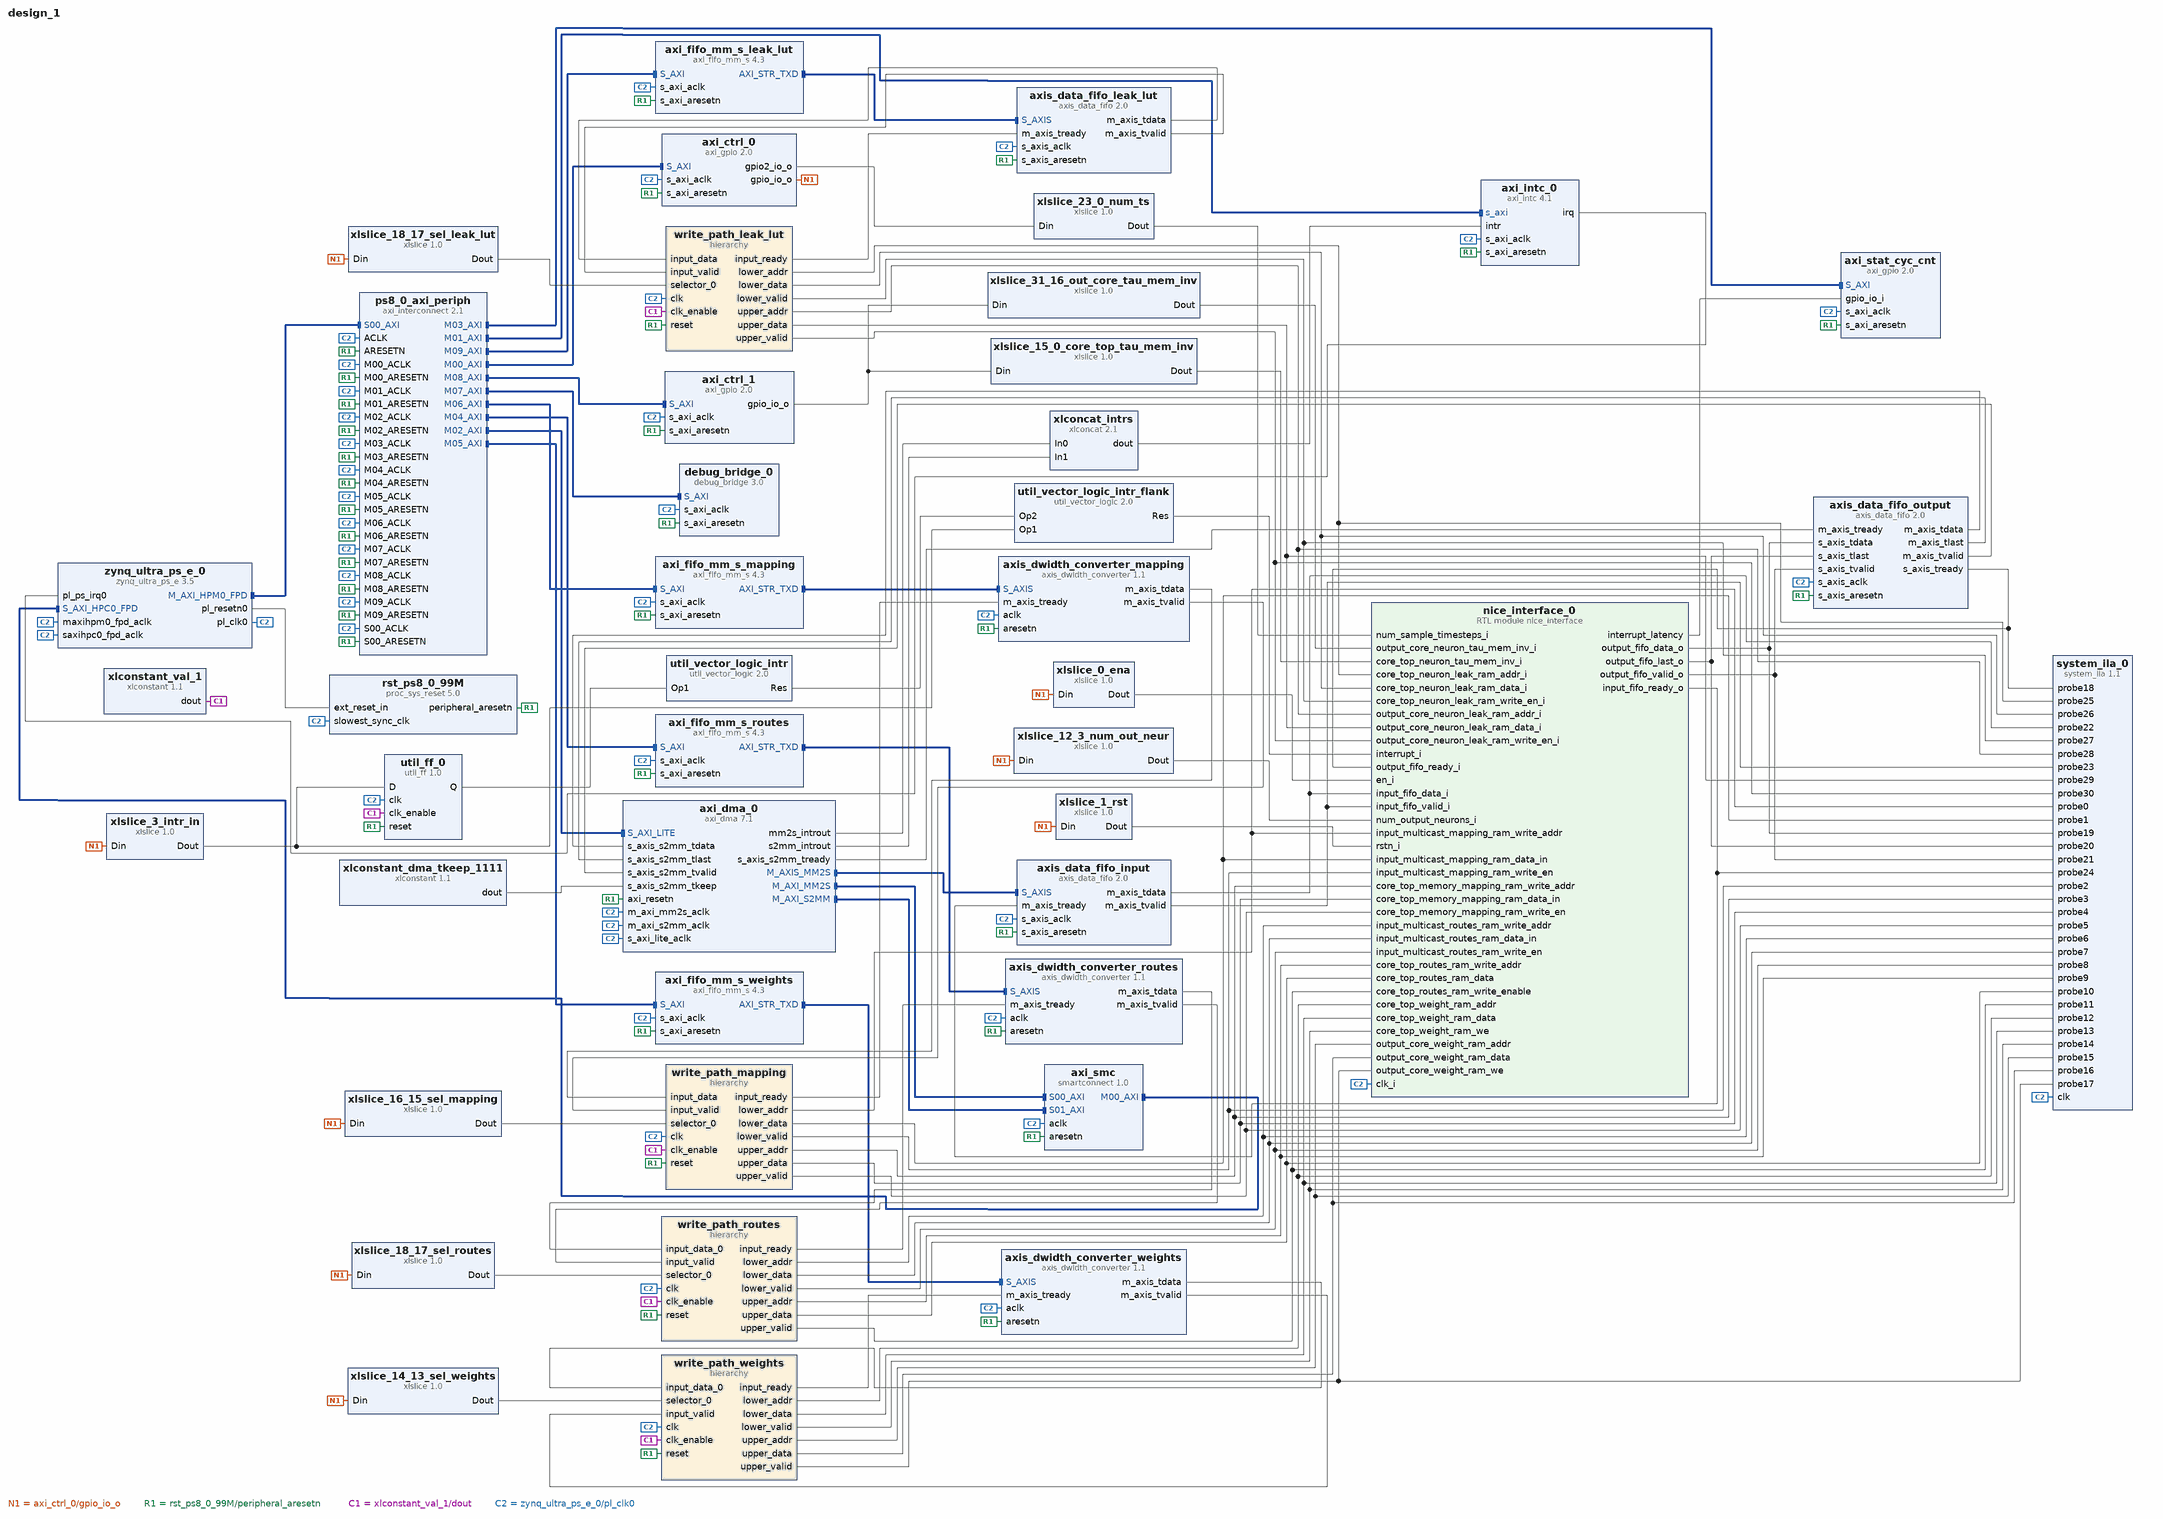
[diagram p0: block diagram of the top level]
# Vivado block design design_1, xck26-sfvc784-2LV-c, Vivado 2024.1
create_bd_design design_1

create_bd_cell -type ip -vlnv xilinx.com:ip:zynq_ultra_ps_e:3.5 zynq_ultra_ps_e_0
set_property -dict [list \
  CONFIG.PSU_BANK_0_IO_STANDARD LVCMOS18 \
  CONFIG.PSU_BANK_1_IO_STANDARD LVCMOS18 \
  CONFIG.PSU_BANK_2_IO_STANDARD LVCMOS18 \
  CONFIG.PSU_BANK_3_IO_STANDARD LVCMOS18 \
  CONFIG.PSU__CRF_APB__ACPU_CTRL__FREQMHZ 1333.333 \
  CONFIG.PSU__CRF_APB__ACPU_CTRL__SRCSEL APLL \
  CONFIG.PSU__CRF_APB__APLL_CTRL__SRCSEL PSS_REF_CLK \
  CONFIG.PSU__CRF_APB__APLL_FRAC_CFG__ENABLED 1 \
  CONFIG.PSU__CRF_APB__DBG_FPD_CTRL__FREQMHZ 250 \
  CONFIG.PSU__CRF_APB__DBG_FPD_CTRL__SRCSEL IOPLL \
  CONFIG.PSU__CRF_APB__DBG_TRACE_CTRL__FREQMHZ 250 \
  CONFIG.PSU__CRF_APB__DBG_TRACE_CTRL__SRCSEL IOPLL \
  CONFIG.PSU__CRF_APB__DBG_TSTMP_CTRL__FREQMHZ 250 \
  CONFIG.PSU__CRF_APB__DBG_TSTMP_CTRL__SRCSEL IOPLL \
  CONFIG.PSU__CRF_APB__DDR_CTRL__FREQMHZ 1200 \
  CONFIG.PSU__CRF_APB__DDR_CTRL__SRCSEL DPLL \
  CONFIG.PSU__CRF_APB__DPDMA_REF_CTRL__FREQMHZ 600 \
  CONFIG.PSU__CRF_APB__DPDMA_REF_CTRL__SRCSEL APLL \
  CONFIG.PSU__CRF_APB__DPLL_CTRL__SRCSEL PSS_REF_CLK \
  CONFIG.PSU__CRF_APB__DP_AUDIO_REF_CTRL__SRCSEL RPLL \
  CONFIG.PSU__CRF_APB__DP_STC_REF_CTRL__SRCSEL RPLL \
  CONFIG.PSU__CRF_APB__DP_VIDEO_REF_CTRL__SRCSEL VPLL \
  CONFIG.PSU__CRF_APB__GDMA_REF_CTRL__FREQMHZ 600 \
  CONFIG.PSU__CRF_APB__GDMA_REF_CTRL__SRCSEL DPLL \
  CONFIG.PSU__CRF_APB__GPU_REF_CTRL__FREQMHZ 600 \
  CONFIG.PSU__CRF_APB__GPU_REF_CTRL__SRCSEL IOPLL \
  CONFIG.PSU__CRF_APB__TOPSW_LSBUS_CTRL__FREQMHZ 100 \
  CONFIG.PSU__CRF_APB__TOPSW_LSBUS_CTRL__SRCSEL IOPLL \
  CONFIG.PSU__CRF_APB__TOPSW_MAIN_CTRL__FREQMHZ 533.33 \
  CONFIG.PSU__CRF_APB__TOPSW_MAIN_CTRL__SRCSEL DPLL \
  CONFIG.PSU__CRF_APB__VPLL_CTRL__SRCSEL PSS_REF_CLK \
  CONFIG.PSU__CRL_APB__ADMA_REF_CTRL__FREQMHZ 500 \
  CONFIG.PSU__CRL_APB__ADMA_REF_CTRL__SRCSEL IOPLL \
  CONFIG.PSU__CRL_APB__CPU_R5_CTRL__FREQMHZ 533.333 \
  CONFIG.PSU__CRL_APB__CPU_R5_CTRL__SRCSEL RPLL \
  CONFIG.PSU__CRL_APB__DBG_LPD_CTRL__FREQMHZ 250 \
  CONFIG.PSU__CRL_APB__DBG_LPD_CTRL__SRCSEL IOPLL \
  CONFIG.PSU__CRL_APB__IOPLL_CTRL__SRCSEL PSS_REF_CLK \
  CONFIG.PSU__CRL_APB__IOU_SWITCH_CTRL__FREQMHZ 250 \
  CONFIG.PSU__CRL_APB__IOU_SWITCH_CTRL__SRCSEL IOPLL \
  CONFIG.PSU__CRL_APB__LPD_LSBUS_CTRL__FREQMHZ 100 \
  CONFIG.PSU__CRL_APB__LPD_LSBUS_CTRL__SRCSEL IOPLL \
  CONFIG.PSU__CRL_APB__LPD_SWITCH_CTRL__FREQMHZ 500 \
  CONFIG.PSU__CRL_APB__LPD_SWITCH_CTRL__SRCSEL IOPLL \
  CONFIG.PSU__CRL_APB__PCAP_CTRL__FREQMHZ 200 \
  CONFIG.PSU__CRL_APB__PCAP_CTRL__SRCSEL IOPLL \
  CONFIG.PSU__CRL_APB__PL0_REF_CTRL__FREQMHZ 100 \
  CONFIG.PSU__CRL_APB__PL0_REF_CTRL__SRCSEL IOPLL \
  CONFIG.PSU__CRL_APB__QSPI_REF_CTRL__FREQMHZ 125 \
  CONFIG.PSU__CRL_APB__QSPI_REF_CTRL__SRCSEL IOPLL \
  CONFIG.PSU__CRL_APB__RPLL_CTRL__SRCSEL PSS_REF_CLK \
  CONFIG.PSU__CRL_APB__SPI1_REF_CTRL__SRCSEL IOPLL \
  CONFIG.PSU__CRL_APB__TIMESTAMP_REF_CTRL__FREQMHZ 100 \
  CONFIG.PSU__CRL_APB__TIMESTAMP_REF_CTRL__SRCSEL IOPLL \
  CONFIG.PSU__CSUPMU__PERIPHERAL__VALID 1 \
  CONFIG.PSU__DDRC__BUS_WIDTH {64 Bit} \
  CONFIG.PSU__DDRC__COMPONENTS Components \
  CONFIG.PSU__DDRC__DEVICE_CAPACITY {8192 MBits} \
  CONFIG.PSU__DDRC__DRAM_WIDTH {16 Bits} \
  CONFIG.PSU__DDRC__ECC Disabled \
  CONFIG.PSU__DDRC__MEMORY_TYPE {DDR 4} \
  CONFIG.PSU__DDRC__SPEED_BIN DDR4_2400R \
  CONFIG.PSU__DDR_HIGH_ADDRESS_GUI_ENABLE 1 \
  CONFIG.PSU__DDR__INTERFACE__FREQMHZ 600.000 \
  CONFIG.PSU__DISPLAYPORT__LANE0__ENABLE 0 \
  CONFIG.PSU__DISPLAYPORT__LANE1__ENABLE 0 \
  CONFIG.PSU__DISPLAYPORT__PERIPHERAL__ENABLE 1 \
  CONFIG.PSU__DPAUX__PERIPHERAL__ENABLE 1 \
  CONFIG.PSU__DPAUX__PERIPHERAL__IO {MIO 27 .. 30} \
  CONFIG.PSU__DP__LANE_SEL None \
  CONFIG.PSU__FPGA_PL0_ENABLE 1 \
  CONFIG.PSU__GPIO0_MIO__IO {MIO 0 .. 25} \
  CONFIG.PSU__GPIO0_MIO__PERIPHERAL__ENABLE 1 \
  CONFIG.PSU__GPIO1_MIO__IO {MIO 26 .. 51} \
  CONFIG.PSU__GPIO1_MIO__PERIPHERAL__ENABLE 1 \
  CONFIG.PSU__GT__LINK_SPEED HBR \
  CONFIG.PSU__GT__PRE_EMPH_LVL_4 0 \
  CONFIG.PSU__GT__VLT_SWNG_LVL_4 0 \
  CONFIG.PSU__IOU_SLCR__IOU_TTC_APB_CLK__TTC0_SEL APB \
  CONFIG.PSU__IOU_SLCR__IOU_TTC_APB_CLK__TTC1_SEL APB \
  CONFIG.PSU__IOU_SLCR__IOU_TTC_APB_CLK__TTC2_SEL APB \
  CONFIG.PSU__IOU_SLCR__IOU_TTC_APB_CLK__TTC3_SEL APB \
  CONFIG.PSU__MAXIGP0__DATA_WIDTH 128 \
  CONFIG.PSU__OVERRIDE__BASIC_CLOCK 0 \
  CONFIG.PSU__PMU_COHERENCY 0 \
  CONFIG.PSU__PMU__AIBACK__ENABLE 0 \
  CONFIG.PSU__PMU__EMIO_GPI__ENABLE 0 \
  CONFIG.PSU__PMU__EMIO_GPO__ENABLE 0 \
  CONFIG.PSU__PMU__GPI0__ENABLE 1 \
  CONFIG.PSU__PMU__GPI0__IO {MIO 26} \
  CONFIG.PSU__PMU__GPI1__ENABLE 0 \
  CONFIG.PSU__PMU__GPI2__ENABLE 0 \
  CONFIG.PSU__PMU__GPI3__ENABLE 0 \
  CONFIG.PSU__PMU__GPI4__ENABLE 0 \
  CONFIG.PSU__PMU__GPI5__ENABLE 1 \
  CONFIG.PSU__PMU__GPI5__IO {MIO 31} \
  CONFIG.PSU__PMU__GPO0__ENABLE 0 \
  CONFIG.PSU__PMU__GPO1__ENABLE 0 \
  CONFIG.PSU__PMU__GPO2__ENABLE 0 \
  CONFIG.PSU__PMU__GPO3__ENABLE 1 \
  CONFIG.PSU__PMU__GPO3__IO {MIO 35} \
  CONFIG.PSU__PMU__GPO3__POLARITY low \
  CONFIG.PSU__PMU__GPO4__ENABLE 0 \
  CONFIG.PSU__PMU__GPO5__ENABLE 0 \
  CONFIG.PSU__PMU__PERIPHERAL__ENABLE 1 \
  CONFIG.PSU__PMU__PLERROR__ENABLE 0 \
  CONFIG.PSU__PRESET_APPLIED 1 \
  CONFIG.PSU__PSS_REF_CLK__FREQMHZ 33.333 \
  CONFIG.PSU__QSPI_COHERENCY 0 \
  CONFIG.PSU__QSPI_ROUTE_THROUGH_FPD 0 \
  CONFIG.PSU__QSPI__GRP_FBCLK__ENABLE 0 \
  CONFIG.PSU__QSPI__PERIPHERAL__DATA_MODE x4 \
  CONFIG.PSU__QSPI__PERIPHERAL__ENABLE 1 \
  CONFIG.PSU__QSPI__PERIPHERAL__IO {MIO 0 .. 5} \
  CONFIG.PSU__QSPI__PERIPHERAL__MODE Single \
  CONFIG.PSU__SPI1__GRP_SS0__IO {MIO 9} \
  CONFIG.PSU__SPI1__PERIPHERAL__ENABLE 1 \
  CONFIG.PSU__SPI1__PERIPHERAL__IO {MIO 6 .. 11} \
  CONFIG.PSU__SWDT0__CLOCK__ENABLE 0 \
  CONFIG.PSU__SWDT0__PERIPHERAL__ENABLE 1 \
  CONFIG.PSU__SWDT0__RESET__ENABLE 0 \
  CONFIG.PSU__SWDT1__CLOCK__ENABLE 0 \
  CONFIG.PSU__SWDT1__PERIPHERAL__ENABLE 1 \
  CONFIG.PSU__SWDT1__RESET__ENABLE 0 \
  CONFIG.PSU__TTC0__CLOCK__ENABLE 0 \
  CONFIG.PSU__TTC0__PERIPHERAL__ENABLE 1 \
  CONFIG.PSU__TTC0__WAVEOUT__ENABLE 0 \
  CONFIG.PSU__TTC1__CLOCK__ENABLE 0 \
  CONFIG.PSU__TTC1__PERIPHERAL__ENABLE 1 \
  CONFIG.PSU__TTC1__WAVEOUT__ENABLE 0 \
  CONFIG.PSU__TTC2__CLOCK__ENABLE 0 \
  CONFIG.PSU__TTC2__PERIPHERAL__ENABLE 1 \
  CONFIG.PSU__TTC2__WAVEOUT__ENABLE 0 \
  CONFIG.PSU__TTC3__CLOCK__ENABLE 0 \
  CONFIG.PSU__TTC3__PERIPHERAL__ENABLE 1 \
  CONFIG.PSU__TTC3__WAVEOUT__ENABLE 0 \
  CONFIG.PSU__USE__IRQ0 1 \
  CONFIG.PSU__USE__M_AXI_GP0 1 \
  CONFIG.PSU__USE__M_AXI_GP1 0 \
  CONFIG.PSU__USE__M_AXI_GP2 0 \
  CONFIG.PSU__USE__S_AXI_GP0 1 \
] [get_bd_cells zynq_ultra_ps_e_0]
# 257 more settings of zynq_ultra_ps_e_0 are not shown: defaults, MIO pin electricals, DDR timing, and values the tool derives
create_bd_cell -type ip -vlnv xilinx.com:ip:axi_gpio:2.0 axi_ctrl_0
set_property -dict {CONFIG.C_ALL_OUTPUTS 1 CONFIG.C_ALL_OUTPUTS_2 1 CONFIG.C_IS_DUAL 1} [get_bd_cells axi_ctrl_0]
create_bd_cell -type ip -vlnv xilinx.com:ip:axi_interconnect:2.1 ps8_0_axi_periph
set_property -dict {CONFIG.NUM_MI 10} [get_bd_cells ps8_0_axi_periph]
create_bd_cell -type ip -vlnv xilinx.com:ip:proc_sys_reset:5.0 rst_ps8_0_99M
create_bd_cell -type ip -vlnv xilinx.com:ip:axi_intc:4.1 axi_intc_0
create_bd_cell -type ip -vlnv xilinx.com:ip:axi_dma:7.1 axi_dma_0
set_property -dict [list \
  CONFIG.c_include_sg 0 \
  CONFIG.c_s_axis_s2mm_tdata_width 32 \
  CONFIG.c_sg_length_width 26 \
] [get_bd_cells axi_dma_0]
create_bd_cell -type ip -vlnv xilinx.com:ip:smartconnect:1.0 axi_smc
set_property -dict {CONFIG.NUM_SI 2} [get_bd_cells axi_smc]
create_bd_cell -type ip -vlnv xilinx.com:ip:xlconcat:2.1 xlconcat_intrs
create_bd_cell -type ip -vlnv xilinx.com:ip:axis_data_fifo:2.0 axis_data_fifo_input
set_property -dict {CONFIG.FIFO_DEPTH 32768 CONFIG.TDATA_NUM_BYTES 4} [get_bd_cells axis_data_fifo_input]
create_bd_cell -type ip -vlnv xilinx.com:ip:axis_data_fifo:2.0 axis_data_fifo_output
set_property -dict [list \
  CONFIG.FIFO_DEPTH 32 \
  CONFIG.FIFO_MEMORY_TYPE distributed \
  CONFIG.HAS_TLAST 1 \
  CONFIG.TDATA_NUM_BYTES 4 \
] [get_bd_cells axis_data_fifo_output]
create_bd_cell -type module -reference nice_interface nice_interface_0
create_bd_cell -type ip -vlnv xilinx.com:ip:xlslice:1.0 xlslice_0_ena
create_bd_cell -type ip -vlnv xilinx.com:ip:xlslice:1.0 xlslice_1_rst
set_property -dict {CONFIG.DIN_FROM 1 CONFIG.DIN_TO 1} [get_bd_cells xlslice_1_rst]
create_bd_cell -type ip -vlnv xilinx.com:ip:xlslice:1.0 xlslice_3_intr_in
set_property -dict {CONFIG.DIN_FROM 2 CONFIG.DIN_TO 2} [get_bd_cells xlslice_3_intr_in]
create_bd_cell -type ip -vlnv xilinx.com:ip:util_ff:1.0 util_ff_0
create_bd_cell -type ip -vlnv xilinx.com:ip:xlconstant:1.1 xlconstant_val_1
create_bd_cell -type ip -vlnv xilinx.com:ip:util_vector_logic:2.0 util_vector_logic_intr
set_property -dict {CONFIG.C_OPERATION not CONFIG.C_SIZE 1} [get_bd_cells util_vector_logic_intr]
create_bd_cell -type ip -vlnv xilinx.com:ip:util_vector_logic:2.0 util_vector_logic_intr_flank
set_property -dict {CONFIG.C_OPERATION and CONFIG.C_SIZE 1} [get_bd_cells util_vector_logic_intr_flank]
create_bd_cell -type ip -vlnv xilinx.com:ip:xlslice:1.0 xlslice_12_3_num_out_neur
set_property -dict {CONFIG.DIN_FROM 12 CONFIG.DIN_TO 3} [get_bd_cells xlslice_12_3_num_out_neur]
create_bd_cell -type ip -vlnv xilinx.com:ip:xlslice:1.0 xlslice_23_0_num_ts
set_property -dict {CONFIG.DIN_FROM 23 CONFIG.DIN_TO 0} [get_bd_cells xlslice_23_0_num_ts]
create_bd_cell -type ip -vlnv xilinx.com:ip:axi_gpio:2.0 axi_stat_cyc_cnt
set_property -dict {CONFIG.C_ALL_INPUTS 1} [get_bd_cells axi_stat_cyc_cnt]
create_bd_cell -type ip -vlnv xilinx.com:ip:axi_fifo_mm_s:4.3 axi_fifo_mm_s_routes
set_property -dict {CONFIG.C_USE_RX_DATA 0 CONFIG.C_USE_TX_CTRL 0} [get_bd_cells axi_fifo_mm_s_routes]
create_bd_cell -type ip -vlnv xilinx.com:ip:axis_dwidth_converter:1.1 axis_dwidth_converter_routes
set_property -dict {CONFIG.M_TDATA_NUM_BYTES 12} [get_bd_cells axis_dwidth_converter_routes]
create_bd_cell -type ip -vlnv xilinx.com:ip:axi_fifo_mm_s:4.3 axi_fifo_mm_s_weights
set_property -dict {CONFIG.C_USE_RX_DATA 0 CONFIG.C_USE_TX_CTRL 0} [get_bd_cells axi_fifo_mm_s_weights]
create_bd_cell -type ip -vlnv xilinx.com:ip:axis_dwidth_converter:1.1 axis_dwidth_converter_weights
set_property -dict {CONFIG.M_TDATA_NUM_BYTES 12} [get_bd_cells axis_dwidth_converter_weights]
create_bd_cell -type ip -vlnv xilinx.com:ip:axi_fifo_mm_s:4.3 axi_fifo_mm_s_mapping
set_property -dict {CONFIG.C_USE_RX_DATA 0 CONFIG.C_USE_TX_CTRL 0} [get_bd_cells axi_fifo_mm_s_mapping]
create_bd_cell -type ip -vlnv xilinx.com:ip:axis_dwidth_converter:1.1 axis_dwidth_converter_mapping
set_property -dict {CONFIG.M_TDATA_NUM_BYTES 8} [get_bd_cells axis_dwidth_converter_mapping]
create_bd_cell -type hier write_path_mapping
create_bd_cell -type hier write_path_weights
create_bd_cell -type hier write_path_routes
create_bd_cell -type ip -vlnv xilinx.com:ip:xlslice:1.0 xlslice_14_13_sel_weights
set_property -dict {CONFIG.DIN_FROM 14 CONFIG.DIN_TO 13} [get_bd_cells xlslice_14_13_sel_weights]
create_bd_cell -type ip -vlnv xilinx.com:ip:xlslice:1.0 xlslice_16_15_sel_mapping
set_property -dict {CONFIG.DIN_FROM 16 CONFIG.DIN_TO 15} [get_bd_cells xlslice_16_15_sel_mapping]
create_bd_cell -type ip -vlnv xilinx.com:ip:xlslice:1.0 xlslice_18_17_sel_routes
set_property -dict {CONFIG.DIN_FROM 18 CONFIG.DIN_TO 17} [get_bd_cells xlslice_18_17_sel_routes]
create_bd_cell -type ip -vlnv xilinx.com:ip:xlconstant:1.1 xlconstant_dma_tkeep_1111
set_property -dict {CONFIG.CONST_VAL 15 CONFIG.CONST_WIDTH 4} [get_bd_cells xlconstant_dma_tkeep_1111]
create_bd_cell -type ip -vlnv xilinx.com:ip:system_ila:1.1 system_ila_0
set_property -dict [list \
  CONFIG.C_MON_TYPE NATIVE \
  CONFIG.C_NUM_OF_PROBES 31 \
  CONFIG.C_PROBE0_TYPE 0 \
  CONFIG.C_PROBE10_TYPE 0 \
  CONFIG.C_PROBE11_TYPE 0 \
  CONFIG.C_PROBE12_TYPE 0 \
  CONFIG.C_PROBE13_TYPE 0 \
  CONFIG.C_PROBE14_TYPE 0 \
  CONFIG.C_PROBE15_TYPE 0 \
  CONFIG.C_PROBE16_TYPE 0 \
  CONFIG.C_PROBE17_TYPE 0 \
  CONFIG.C_PROBE18_TYPE 0 \
  CONFIG.C_PROBE19_TYPE 0 \
  CONFIG.C_PROBE1_TYPE 0 \
  CONFIG.C_PROBE20_TYPE 0 \
  CONFIG.C_PROBE21_TYPE 0 \
  CONFIG.C_PROBE22_TYPE 0 \
  CONFIG.C_PROBE23_TYPE 0 \
  CONFIG.C_PROBE24_TYPE 0 \
  CONFIG.C_PROBE25_TYPE 0 \
  CONFIG.C_PROBE26_TYPE 0 \
  CONFIG.C_PROBE27_TYPE 0 \
  CONFIG.C_PROBE28_TYPE 0 \
  CONFIG.C_PROBE29_TYPE 0 \
  CONFIG.C_PROBE2_TYPE 0 \
  CONFIG.C_PROBE30_TYPE 0 \
  CONFIG.C_PROBE3_TYPE 0 \
  CONFIG.C_PROBE4_TYPE 0 \
  CONFIG.C_PROBE5_TYPE 0 \
  CONFIG.C_PROBE6_TYPE 0 \
  CONFIG.C_PROBE7_TYPE 0 \
  CONFIG.C_PROBE8_TYPE 0 \
  CONFIG.C_PROBE9_TYPE 0 \
] [get_bd_cells system_ila_0]
create_bd_cell -type ip -vlnv xilinx.com:ip:debug_bridge:3.0 debug_bridge_0
set_property -dict {CONFIG.C_DEBUG_MODE 2} [get_bd_cells debug_bridge_0]
create_bd_cell -type ip -vlnv xilinx.com:ip:axi_gpio:2.0 axi_ctrl_1
set_property -dict {CONFIG.C_ALL_OUTPUTS 1} [get_bd_cells axi_ctrl_1]
create_bd_cell -type ip -vlnv xilinx.com:ip:xlslice:1.0 xlslice_31_16_out_core_tau_mem_inv
set_property -dict {CONFIG.DIN_FROM 31 CONFIG.DIN_TO 16} [get_bd_cells xlslice_31_16_out_core_tau_mem_inv]
create_bd_cell -type ip -vlnv xilinx.com:ip:xlslice:1.0 xlslice_15_0_core_top_tau_mem_inv
set_property -dict {CONFIG.DIN_FROM 15 CONFIG.DIN_TO 0} [get_bd_cells xlslice_15_0_core_top_tau_mem_inv]
create_bd_cell -type hier write_path_leak_lut
create_bd_cell -type ip -vlnv xilinx.com:ip:axi_fifo_mm_s:4.3 axi_fifo_mm_s_leak_lut
set_property -dict {CONFIG.C_USE_RX_DATA 0 CONFIG.C_USE_TX_CTRL 0} [get_bd_cells axi_fifo_mm_s_leak_lut]
create_bd_cell -type ip -vlnv xilinx.com:ip:axis_data_fifo:2.0 axis_data_fifo_leak_lut
set_property -dict [list \
  CONFIG.FIFO_DEPTH 16 \
  CONFIG.FIFO_MEMORY_TYPE distributed \
  CONFIG.TDATA_NUM_BYTES 4 \
] [get_bd_cells axis_data_fifo_leak_lut]
create_bd_cell -type ip -vlnv xilinx.com:ip:xlslice:1.0 xlslice_18_17_sel_leak_lut
set_property -dict {CONFIG.DIN_FROM 20 CONFIG.DIN_TO 19} [get_bd_cells xlslice_18_17_sel_leak_lut]

# ---- hierarchy /write_path_mapping ----
current_bd_instance /write_path_mapping
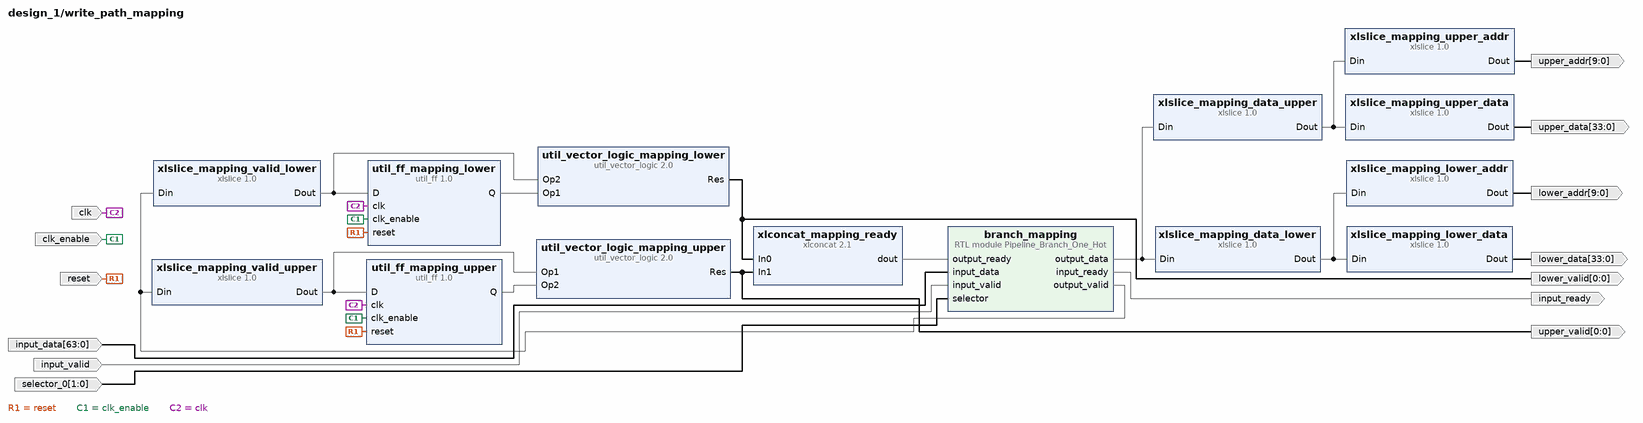
[diagram p1: block diagram inside /write_path_mapping]
create_bd_pin -dir I -from 1 -to 0 selector_0
create_bd_pin -dir I input_valid
create_bd_pin -dir O input_ready
create_bd_pin -dir I -from 63 -to 0 input_data
create_bd_pin -dir O -from 9 -to 0 upper_addr
create_bd_pin -dir I -type clk clk
create_bd_pin -dir I -type rst reset
create_bd_pin -dir I clk_enable
create_bd_pin -dir O -from 9 -to 0 lower_addr
create_bd_pin -dir O -from 0 -to 0 lower_valid
create_bd_pin -dir O -from 0 -to 0 upper_valid
create_bd_pin -dir O -from 33 -to 0 upper_data
create_bd_pin -dir O -from 33 -to 0 lower_data

create_bd_cell -type ip -vlnv xilinx.com:ip:util_vector_logic:2.0 util_vector_logic_mapping_lower
set_property -dict {CONFIG.C_SIZE 1} [get_bd_cells util_vector_logic_mapping_lower]
create_bd_cell -type ip -vlnv xilinx.com:ip:xlslice:1.0 xlslice_mapping_data_upper
set_property -dict {CONFIG.DIN_FROM 127 CONFIG.DIN_TO 64 CONFIG.DIN_WIDTH 128} [get_bd_cells xlslice_mapping_data_upper]
create_bd_cell -type ip -vlnv xilinx.com:ip:xlslice:1.0 xlslice_mapping_valid_upper
set_property -dict {CONFIG.DIN_FROM 1 CONFIG.DIN_TO 1 CONFIG.DIN_WIDTH 2} [get_bd_cells xlslice_mapping_valid_upper]
create_bd_cell -type ip -vlnv xilinx.com:ip:xlslice:1.0 xlslice_mapping_lower_data
set_property -dict {CONFIG.DIN_FROM 33 CONFIG.DIN_WIDTH 64} [get_bd_cells xlslice_mapping_lower_data]
create_bd_cell -type module -reference Pipeline_Branch_One_Hot branch_mapping
set_property -dict {CONFIG.OUTPUT_COUNT 2 CONFIG.TOTAL_WIDTH 128 CONFIG.WORD_WIDTH 64} [get_bd_cells branch_mapping]
create_bd_cell -type ip -vlnv xilinx.com:ip:util_vector_logic:2.0 util_vector_logic_mapping_upper
set_property -dict {CONFIG.C_SIZE 1} [get_bd_cells util_vector_logic_mapping_upper]
create_bd_cell -type ip -vlnv xilinx.com:ip:xlslice:1.0 xlslice_mapping_data_lower
set_property -dict {CONFIG.DIN_FROM 63 CONFIG.DIN_TO 0 CONFIG.DIN_WIDTH 128} [get_bd_cells xlslice_mapping_data_lower]
create_bd_cell -type ip -vlnv xilinx.com:ip:xlslice:1.0 xlslice_mapping_upper_addr
set_property -dict {CONFIG.DIN_FROM 43 CONFIG.DIN_TO 34 CONFIG.DIN_WIDTH 64} [get_bd_cells xlslice_mapping_upper_addr]
create_bd_cell -type ip -vlnv xilinx.com:ip:util_ff:1.0 util_ff_mapping_upper
create_bd_cell -type ip -vlnv xilinx.com:ip:xlslice:1.0 xlslice_mapping_upper_data
set_property -dict {CONFIG.DIN_FROM 33 CONFIG.DIN_WIDTH 64} [get_bd_cells xlslice_mapping_upper_data]
create_bd_cell -type ip -vlnv xilinx.com:ip:xlconcat:2.1 xlconcat_mapping_ready
create_bd_cell -type ip -vlnv xilinx.com:ip:xlslice:1.0 xlslice_mapping_lower_addr
set_property -dict {CONFIG.DIN_FROM 43 CONFIG.DIN_TO 34 CONFIG.DIN_WIDTH 64} [get_bd_cells xlslice_mapping_lower_addr]
create_bd_cell -type ip -vlnv xilinx.com:ip:util_ff:1.0 util_ff_mapping_lower
create_bd_cell -type ip -vlnv xilinx.com:ip:xlslice:1.0 xlslice_mapping_valid_lower
set_property -dict {CONFIG.DIN_FROM 0 CONFIG.DIN_TO 0 CONFIG.DIN_WIDTH 2} [get_bd_cells xlslice_mapping_valid_lower]

# ---- hierarchy /write_path_weights ----
current_bd_instance /write_path_weights
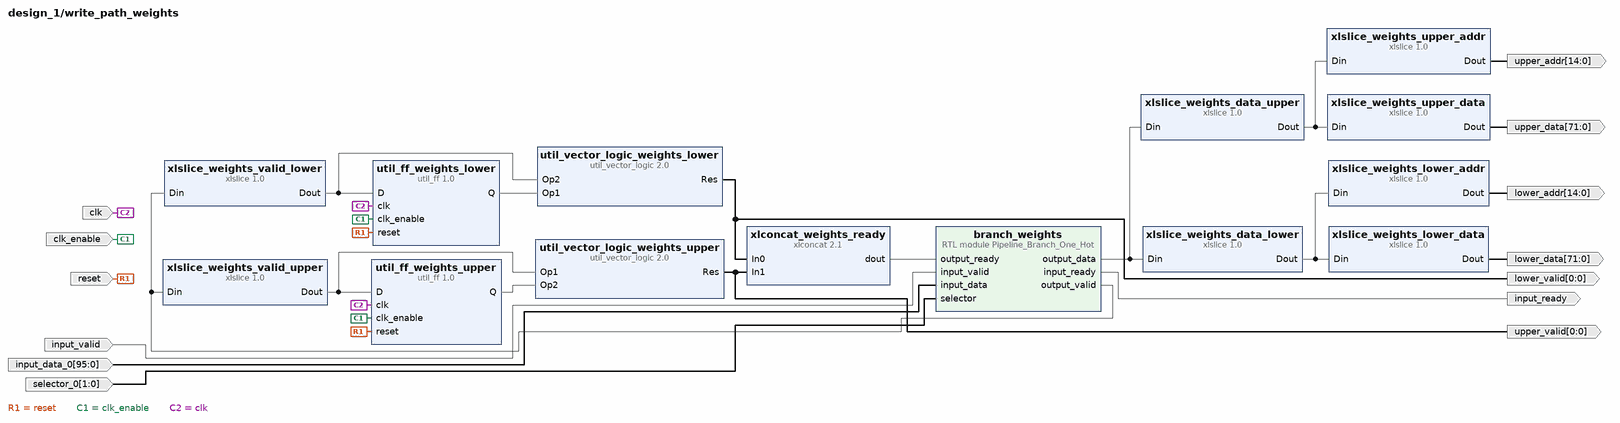
[diagram p2: block diagram inside /write_path_weights]
create_bd_pin -dir I -from 1 -to 0 selector_0
create_bd_pin -dir I input_valid
create_bd_pin -dir O input_ready
create_bd_pin -dir I -type clk clk
create_bd_pin -dir I -type rst reset
create_bd_pin -dir I clk_enable
create_bd_pin -dir I -from 95 -to 0 input_data_0
create_bd_pin -dir O -from 71 -to 0 upper_data
create_bd_pin -dir O -from 71 -to 0 lower_data
create_bd_pin -dir O -from 0 -to 0 lower_valid
create_bd_pin -dir O -from 0 -to 0 upper_valid
create_bd_pin -dir O -from 14 -to 0 upper_addr
create_bd_pin -dir O -from 14 -to 0 lower_addr

create_bd_cell -type ip -vlnv xilinx.com:ip:util_vector_logic:2.0 util_vector_logic_weights_lower
set_property -dict {CONFIG.C_SIZE 1} [get_bd_cells util_vector_logic_weights_lower]
create_bd_cell -type ip -vlnv xilinx.com:ip:xlslice:1.0 xlslice_weights_data_upper
set_property -dict {CONFIG.DIN_FROM 191 CONFIG.DIN_TO 96 CONFIG.DIN_WIDTH 192} [get_bd_cells xlslice_weights_data_upper]
create_bd_cell -type ip -vlnv xilinx.com:ip:xlslice:1.0 xlslice_weights_valid_upper
set_property -dict {CONFIG.DIN_FROM 1 CONFIG.DIN_TO 1 CONFIG.DIN_WIDTH 2} [get_bd_cells xlslice_weights_valid_upper]
create_bd_cell -type ip -vlnv xilinx.com:ip:xlslice:1.0 xlslice_weights_lower_data
set_property -dict {CONFIG.DIN_FROM 71 CONFIG.DIN_WIDTH 96} [get_bd_cells xlslice_weights_lower_data]
create_bd_cell -type module -reference Pipeline_Branch_One_Hot branch_weights
set_property -dict {CONFIG.OUTPUT_COUNT 2 CONFIG.TOTAL_WIDTH 192 CONFIG.WORD_WIDTH 96} [get_bd_cells branch_weights]
create_bd_cell -type ip -vlnv xilinx.com:ip:util_vector_logic:2.0 util_vector_logic_weights_upper
set_property -dict {CONFIG.C_SIZE 1} [get_bd_cells util_vector_logic_weights_upper]
create_bd_cell -type ip -vlnv xilinx.com:ip:xlslice:1.0 xlslice_weights_data_lower
set_property -dict {CONFIG.DIN_FROM 95 CONFIG.DIN_TO 0 CONFIG.DIN_WIDTH 192} [get_bd_cells xlslice_weights_data_lower]
create_bd_cell -type ip -vlnv xilinx.com:ip:xlslice:1.0 xlslice_weights_upper_addr
set_property -dict {CONFIG.DIN_FROM 86 CONFIG.DIN_TO 72 CONFIG.DIN_WIDTH 96} [get_bd_cells xlslice_weights_upper_addr]
create_bd_cell -type ip -vlnv xilinx.com:ip:util_ff:1.0 util_ff_weights_upper
create_bd_cell -type ip -vlnv xilinx.com:ip:xlslice:1.0 xlslice_weights_upper_data
set_property -dict {CONFIG.DIN_FROM 71 CONFIG.DIN_WIDTH 96} [get_bd_cells xlslice_weights_upper_data]
create_bd_cell -type ip -vlnv xilinx.com:ip:xlconcat:2.1 xlconcat_weights_ready
create_bd_cell -type ip -vlnv xilinx.com:ip:xlslice:1.0 xlslice_weights_lower_addr
set_property -dict {CONFIG.DIN_FROM 86 CONFIG.DIN_TO 72 CONFIG.DIN_WIDTH 96} [get_bd_cells xlslice_weights_lower_addr]
create_bd_cell -type ip -vlnv xilinx.com:ip:util_ff:1.0 util_ff_weights_lower
create_bd_cell -type ip -vlnv xilinx.com:ip:xlslice:1.0 xlslice_weights_valid_lower
set_property -dict {CONFIG.DIN_FROM 0 CONFIG.DIN_TO 0 CONFIG.DIN_WIDTH 2} [get_bd_cells xlslice_weights_valid_lower]

# ---- hierarchy /write_path_routes ----
current_bd_instance /write_path_routes
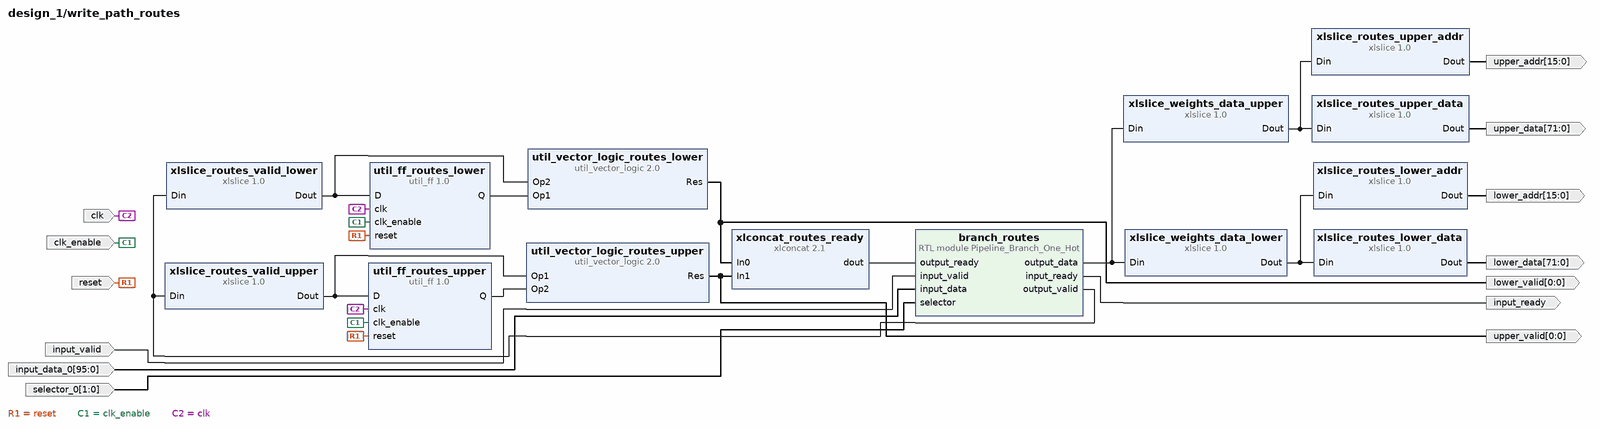
[diagram p3: block diagram inside /write_path_routes]
create_bd_pin -dir I -from 1 -to 0 selector_0
create_bd_pin -dir I input_valid
create_bd_pin -dir O input_ready
create_bd_pin -dir I -type clk clk
create_bd_pin -dir I -type rst reset
create_bd_pin -dir I clk_enable
create_bd_pin -dir I -from 95 -to 0 input_data_0
create_bd_pin -dir O -from 71 -to 0 upper_data
create_bd_pin -dir O -from 71 -to 0 lower_data
create_bd_pin -dir O -from 0 -to 0 lower_valid
create_bd_pin -dir O -from 15 -to 0 upper_addr
create_bd_pin -dir O -from 15 -to 0 lower_addr
create_bd_pin -dir O -from 0 -to 0 upper_valid

create_bd_cell -type ip -vlnv xilinx.com:ip:util_vector_logic:2.0 util_vector_logic_routes_lower
set_property -dict {CONFIG.C_SIZE 1} [get_bd_cells util_vector_logic_routes_lower]
create_bd_cell -type ip -vlnv xilinx.com:ip:xlslice:1.0 xlslice_weights_data_upper
set_property -dict {CONFIG.DIN_FROM 191 CONFIG.DIN_TO 96 CONFIG.DIN_WIDTH 192} [get_bd_cells xlslice_weights_data_upper]
create_bd_cell -type ip -vlnv xilinx.com:ip:xlslice:1.0 xlslice_routes_valid_upper
set_property -dict {CONFIG.DIN_FROM 1 CONFIG.DIN_TO 1 CONFIG.DIN_WIDTH 2} [get_bd_cells xlslice_routes_valid_upper]
create_bd_cell -type ip -vlnv xilinx.com:ip:xlslice:1.0 xlslice_routes_lower_data
set_property -dict {CONFIG.DIN_FROM 71 CONFIG.DIN_WIDTH 96} [get_bd_cells xlslice_routes_lower_data]
create_bd_cell -type module -reference Pipeline_Branch_One_Hot branch_routes
set_property -dict {CONFIG.OUTPUT_COUNT 2 CONFIG.TOTAL_WIDTH 192 CONFIG.WORD_WIDTH 96} [get_bd_cells branch_routes]
create_bd_cell -type ip -vlnv xilinx.com:ip:xlslice:1.0 xlslice_weights_data_lower
set_property -dict {CONFIG.DIN_FROM 95 CONFIG.DIN_TO 0 CONFIG.DIN_WIDTH 192} [get_bd_cells xlslice_weights_data_lower]
create_bd_cell -type ip -vlnv xilinx.com:ip:xlslice:1.0 xlslice_routes_upper_addr
set_property -dict {CONFIG.DIN_FROM 87 CONFIG.DIN_TO 72 CONFIG.DIN_WIDTH 96} [get_bd_cells xlslice_routes_upper_addr]
create_bd_cell -type ip -vlnv xilinx.com:ip:util_ff:1.0 util_ff_routes_upper
create_bd_cell -type ip -vlnv xilinx.com:ip:xlslice:1.0 xlslice_routes_upper_data
set_property -dict {CONFIG.DIN_FROM 71 CONFIG.DIN_WIDTH 96} [get_bd_cells xlslice_routes_upper_data]
create_bd_cell -type ip -vlnv xilinx.com:ip:xlconcat:2.1 xlconcat_routes_ready
create_bd_cell -type ip -vlnv xilinx.com:ip:xlslice:1.0 xlslice_routes_lower_addr
set_property -dict {CONFIG.DIN_FROM 87 CONFIG.DIN_TO 72 CONFIG.DIN_WIDTH 96} [get_bd_cells xlslice_routes_lower_addr]
create_bd_cell -type ip -vlnv xilinx.com:ip:util_ff:1.0 util_ff_routes_lower
create_bd_cell -type ip -vlnv xilinx.com:ip:xlslice:1.0 xlslice_routes_valid_lower
set_property -dict {CONFIG.DIN_FROM 0 CONFIG.DIN_TO 0 CONFIG.DIN_WIDTH 2} [get_bd_cells xlslice_routes_valid_lower]
create_bd_cell -type ip -vlnv xilinx.com:ip:util_vector_logic:2.0 util_vector_logic_routes_upper
set_property -dict {CONFIG.C_SIZE 1} [get_bd_cells util_vector_logic_routes_upper]

# ---- hierarchy /write_path_leak_lut ----
current_bd_instance /write_path_leak_lut
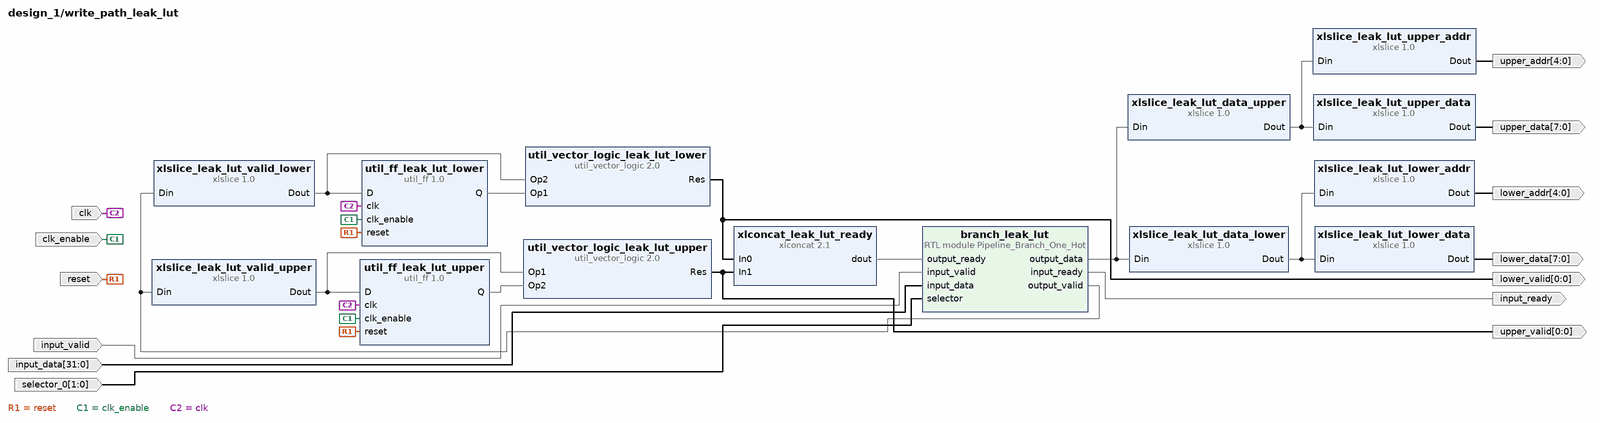
[diagram p4: block diagram inside /write_path_leak_lut]
create_bd_pin -dir I -from 1 -to 0 selector_0
create_bd_pin -dir I input_valid
create_bd_pin -dir O input_ready
create_bd_pin -dir I -type clk clk
create_bd_pin -dir I -type rst reset
create_bd_pin -dir I clk_enable
create_bd_pin -dir O -from 0 -to 0 lower_valid
create_bd_pin -dir O -from 0 -to 0 upper_valid
create_bd_pin -dir I -from 31 -to 0 input_data
create_bd_pin -dir O -from 7 -to 0 upper_data
create_bd_pin -dir O -from 7 -to 0 lower_data
create_bd_pin -dir O -from 4 -to 0 lower_addr
create_bd_pin -dir O -from 4 -to 0 upper_addr

create_bd_cell -type ip -vlnv xilinx.com:ip:util_vector_logic:2.0 util_vector_logic_leak_lut_lower
set_property -dict {CONFIG.C_SIZE 1} [get_bd_cells util_vector_logic_leak_lut_lower]
create_bd_cell -type ip -vlnv xilinx.com:ip:xlslice:1.0 xlslice_leak_lut_data_upper
set_property -dict {CONFIG.DIN_FROM 63 CONFIG.DIN_TO 32 CONFIG.DIN_WIDTH 64} [get_bd_cells xlslice_leak_lut_data_upper]
create_bd_cell -type ip -vlnv xilinx.com:ip:xlslice:1.0 xlslice_leak_lut_valid_upper
set_property -dict {CONFIG.DIN_FROM 1 CONFIG.DIN_TO 1 CONFIG.DIN_WIDTH 2} [get_bd_cells xlslice_leak_lut_valid_upper]
create_bd_cell -type ip -vlnv xilinx.com:ip:xlslice:1.0 xlslice_leak_lut_lower_data
set_property -dict {CONFIG.DIN_FROM 7 CONFIG.DIN_WIDTH 32} [get_bd_cells xlslice_leak_lut_lower_data]
create_bd_cell -type module -reference Pipeline_Branch_One_Hot branch_leak_lut
set_property -dict {CONFIG.OUTPUT_COUNT 2 CONFIG.TOTAL_WIDTH 64 CONFIG.WORD_WIDTH 32} [get_bd_cells branch_leak_lut]
create_bd_cell -type ip -vlnv xilinx.com:ip:util_vector_logic:2.0 util_vector_logic_leak_lut_upper
set_property -dict {CONFIG.C_SIZE 1} [get_bd_cells util_vector_logic_leak_lut_upper]
create_bd_cell -type ip -vlnv xilinx.com:ip:xlslice:1.0 xlslice_leak_lut_data_lower
set_property -dict {CONFIG.DIN_FROM 31 CONFIG.DIN_TO 0 CONFIG.DIN_WIDTH 64} [get_bd_cells xlslice_leak_lut_data_lower]
create_bd_cell -type ip -vlnv xilinx.com:ip:xlslice:1.0 xlslice_leak_lut_upper_addr
set_property -dict {CONFIG.DIN_FROM 12 CONFIG.DIN_TO 8 CONFIG.DIN_WIDTH 32} [get_bd_cells xlslice_leak_lut_upper_addr]
create_bd_cell -type ip -vlnv xilinx.com:ip:util_ff:1.0 util_ff_leak_lut_upper
create_bd_cell -type ip -vlnv xilinx.com:ip:xlslice:1.0 xlslice_leak_lut_upper_data
set_property -dict {CONFIG.DIN_FROM 7 CONFIG.DIN_WIDTH 32} [get_bd_cells xlslice_leak_lut_upper_data]
create_bd_cell -type ip -vlnv xilinx.com:ip:xlconcat:2.1 xlconcat_leak_lut_ready
create_bd_cell -type ip -vlnv xilinx.com:ip:xlslice:1.0 xlslice_leak_lut_lower_addr
set_property -dict {CONFIG.DIN_FROM 12 CONFIG.DIN_TO 8 CONFIG.DIN_WIDTH 32} [get_bd_cells xlslice_leak_lut_lower_addr]
create_bd_cell -type ip -vlnv xilinx.com:ip:util_ff:1.0 util_ff_leak_lut_lower
create_bd_cell -type ip -vlnv xilinx.com:ip:xlslice:1.0 xlslice_leak_lut_valid_lower
set_property -dict {CONFIG.DIN_FROM 0 CONFIG.DIN_TO 0 CONFIG.DIN_WIDTH 2} [get_bd_cells xlslice_leak_lut_valid_lower]

# ---- connections ----

current_bd_instance /write_path_mapping
connect_bd_net -net axis_dwidth_converter_mapping_m_axis_tdata [get_bd_pins input_data] [get_bd_pins branch_mapping/input_data]
connect_bd_net -net axis_dwidth_converter_mapping_m_axis_tvalid [get_bd_pins input_valid] [get_bd_pins branch_mapping/input_valid]
connect_bd_net [get_bd_pins branch_mapping/input_ready] [get_bd_pins input_ready]
connect_bd_net [get_bd_pins branch_mapping/output_data] [get_bd_pins xlslice_mapping_data_lower/Din] [get_bd_pins xlslice_mapping_data_upper/Din]
connect_bd_net [get_bd_pins branch_mapping/output_valid] [get_bd_pins xlslice_mapping_valid_upper/Din] [get_bd_pins xlslice_mapping_valid_lower/Din]
connect_bd_net -net rst_ps8_0_99M_peripheral_aresetn [get_bd_pins reset] \
  [get_bd_pins util_ff_mapping_lower/reset] [get_bd_pins util_ff_mapping_upper/reset]
connect_bd_net -net selector_0_1 [get_bd_pins selector_0] [get_bd_pins branch_mapping/selector]
connect_bd_net [get_bd_pins util_ff_mapping_lower/Q] [get_bd_pins util_vector_logic_mapping_lower/Op1]
connect_bd_net [get_bd_pins util_ff_mapping_upper/Q] [get_bd_pins util_vector_logic_mapping_upper/Op2]
connect_bd_net -net util_vector_logic_mapping_lower_Res [get_bd_pins util_vector_logic_mapping_lower/Res] \
  [get_bd_pins xlconcat_mapping_ready/In0] [get_bd_pins lower_valid]
connect_bd_net -net util_vector_logic_mapping_upper_Res [get_bd_pins util_vector_logic_mapping_upper/Res] \
  [get_bd_pins xlconcat_mapping_ready/In1] [get_bd_pins upper_valid]
connect_bd_net [get_bd_pins xlconcat_mapping_ready/dout] [get_bd_pins branch_mapping/output_ready]
connect_bd_net -net xlconstant_val_1_dout [get_bd_pins clk_enable] \
  [get_bd_pins util_ff_mapping_lower/clk_enable] [get_bd_pins util_ff_mapping_upper/clk_enable]
connect_bd_net [get_bd_pins xlslice_mapping_data_lower/Dout] [get_bd_pins xlslice_mapping_lower_addr/Din] [get_bd_pins xlslice_mapping_lower_data/Din]
connect_bd_net [get_bd_pins xlslice_mapping_data_upper/Dout] [get_bd_pins xlslice_mapping_upper_addr/Din] [get_bd_pins xlslice_mapping_upper_data/Din]
connect_bd_net -net xlslice_mapping_lower_addr_Dout [get_bd_pins xlslice_mapping_lower_addr/Dout] [get_bd_pins lower_addr]
connect_bd_net -net xlslice_mapping_lower_data_Dout [get_bd_pins xlslice_mapping_lower_data/Dout] [get_bd_pins lower_data]
connect_bd_net -net xlslice_mapping_upper_addr_Dout [get_bd_pins xlslice_mapping_upper_addr/Dout] [get_bd_pins upper_addr]
connect_bd_net -net xlslice_mapping_upper_data_Dout [get_bd_pins xlslice_mapping_upper_data/Dout] [get_bd_pins upper_data]
connect_bd_net [get_bd_pins xlslice_mapping_valid_lower/Dout] [get_bd_pins util_ff_mapping_lower/D] [get_bd_pins util_vector_logic_mapping_lower/Op2]
connect_bd_net [get_bd_pins xlslice_mapping_valid_upper/Dout] [get_bd_pins util_ff_mapping_upper/D] [get_bd_pins util_vector_logic_mapping_upper/Op1]
connect_bd_net -net zynq_ultra_ps_e_0_pl_clk0 [get_bd_pins clk] [get_bd_pins util_ff_mapping_lower/clk] [get_bd_pins util_ff_mapping_upper/clk]
set_property HDL_ATTRIBUTE.DEBUG true [get_bd_nets util_vector_logic_mapping_lower_Res]
set_property HDL_ATTRIBUTE.DEBUG true [get_bd_nets util_vector_logic_mapping_upper_Res]
set_property HDL_ATTRIBUTE.DEBUG true [get_bd_nets xlslice_mapping_lower_addr_Dout]
set_property HDL_ATTRIBUTE.DEBUG true [get_bd_nets xlslice_mapping_lower_data_Dout]
set_property HDL_ATTRIBUTE.DEBUG true [get_bd_nets xlslice_mapping_upper_addr_Dout]
set_property HDL_ATTRIBUTE.DEBUG true [get_bd_nets xlslice_mapping_upper_data_Dout]

current_bd_instance /write_path_weights
connect_bd_net -net axis_dwidth_converter_mapping_m_axis_tvalid [get_bd_pins input_valid] [get_bd_pins branch_weights/input_valid]
connect_bd_net -net branch_mapping_input_ready [get_bd_pins branch_weights/input_ready] [get_bd_pins input_ready]
connect_bd_net -net branch_mapping_output_data [get_bd_pins branch_weights/output_data] \
  [get_bd_pins xlslice_weights_data_lower/Din] [get_bd_pins xlslice_weights_data_upper/Din]
connect_bd_net -net branch_mapping_output_valid [get_bd_pins branch_weights/output_valid] \
  [get_bd_pins xlslice_weights_valid_upper/Din] [get_bd_pins xlslice_weights_valid_lower/Din]
connect_bd_net -net input_data_0_1 [get_bd_pins input_data_0] [get_bd_pins branch_weights/input_data]
connect_bd_net -net rst_ps8_0_99M_peripheral_aresetn [get_bd_pins reset] \
  [get_bd_pins util_ff_weights_lower/reset] [get_bd_pins util_ff_weights_upper/reset]
connect_bd_net -net selector_0_1 [get_bd_pins selector_0] [get_bd_pins branch_weights/selector]
connect_bd_net -net util_ff_mapping_lower_Q [get_bd_pins util_ff_weights_lower/Q] [get_bd_pins util_vector_logic_weights_lower/Op1]
connect_bd_net -net util_ff_mapping_upper_Q [get_bd_pins util_ff_weights_upper/Q] [get_bd_pins util_vector_logic_weights_upper/Op2]
connect_bd_net -net util_vector_logic_mapping_lower_Res [get_bd_pins util_vector_logic_weights_lower/Res] \
  [get_bd_pins xlconcat_weights_ready/In0] [get_bd_pins lower_valid]
connect_bd_net -net util_vector_logic_mapping_upper_Res [get_bd_pins util_vector_logic_weights_upper/Res] \
  [get_bd_pins xlconcat_weights_ready/In1] [get_bd_pins upper_valid]
connect_bd_net -net xlconcat_mapping_ready_dout [get_bd_pins xlconcat_weights_ready/dout] [get_bd_pins branch_weights/output_ready]
connect_bd_net -net xlconstant_val_1_dout [get_bd_pins clk_enable] \
  [get_bd_pins util_ff_weights_lower/clk_enable] [get_bd_pins util_ff_weights_upper/clk_enable]
connect_bd_net -net xlslice_mapping_data_lower_Dout [get_bd_pins xlslice_weights_data_lower/Dout] \
  [get_bd_pins xlslice_weights_lower_addr/Din] [get_bd_pins xlslice_weights_lower_data/Din]
connect_bd_net -net xlslice_mapping_data_upper_Dout [get_bd_pins xlslice_weights_data_upper/Dout] \
  [get_bd_pins xlslice_weights_upper_addr/Din] [get_bd_pins xlslice_weights_upper_data/Din]
connect_bd_net -net xlslice_mapping_valid_lower_Dout [get_bd_pins xlslice_weights_valid_lower/Dout] \
  [get_bd_pins util_ff_weights_lower/D] [get_bd_pins util_vector_logic_weights_lower/Op2]
connect_bd_net -net xlslice_mapping_valid_upper_Dout [get_bd_pins xlslice_weights_valid_upper/Dout] \
  [get_bd_pins util_ff_weights_upper/D] [get_bd_pins util_vector_logic_weights_upper/Op1]
connect_bd_net -net xlslice_weights_lower_addr_Dout [get_bd_pins xlslice_weights_lower_addr/Dout] [get_bd_pins lower_addr]
connect_bd_net -net xlslice_weights_lower_data_Dout [get_bd_pins xlslice_weights_lower_data/Dout] [get_bd_pins lower_data]
connect_bd_net -net xlslice_weights_upper_addr_Dout [get_bd_pins xlslice_weights_upper_addr/Dout] [get_bd_pins upper_addr]
connect_bd_net -net xlslice_weights_upper_data_Dout [get_bd_pins xlslice_weights_upper_data/Dout] [get_bd_pins upper_data]
connect_bd_net -net zynq_ultra_ps_e_0_pl_clk0 [get_bd_pins clk] [get_bd_pins util_ff_weights_lower/clk] [get_bd_pins util_ff_weights_upper/clk]
set_property HDL_ATTRIBUTE.DEBUG true [get_bd_nets util_vector_logic_mapping_lower_Res]
set_property HDL_ATTRIBUTE.DEBUG true [get_bd_nets util_vector_logic_mapping_upper_Res]
set_property HDL_ATTRIBUTE.DEBUG true [get_bd_nets xlslice_weights_lower_addr_Dout]
set_property HDL_ATTRIBUTE.DEBUG true [get_bd_nets xlslice_weights_lower_data_Dout]
set_property HDL_ATTRIBUTE.DEBUG true [get_bd_nets xlslice_weights_upper_addr_Dout]
set_property HDL_ATTRIBUTE.DEBUG true [get_bd_nets xlslice_weights_upper_data_Dout]

current_bd_instance /write_path_routes
connect_bd_net -net axis_dwidth_converter_mapping_m_axis_tvalid [get_bd_pins input_valid] [get_bd_pins branch_routes/input_valid]
connect_bd_net -net branch_mapping_input_ready [get_bd_pins branch_routes/input_ready] [get_bd_pins input_ready]
connect_bd_net -net branch_mapping_output_data [get_bd_pins branch_routes/output_data] \
  [get_bd_pins xlslice_weights_data_lower/Din] [get_bd_pins xlslice_weights_data_upper/Din]
connect_bd_net -net branch_mapping_output_valid [get_bd_pins branch_routes/output_valid] \
  [get_bd_pins xlslice_routes_valid_upper/Din] [get_bd_pins xlslice_routes_valid_lower/Din]
connect_bd_net -net input_data_0_1 [get_bd_pins input_data_0] [get_bd_pins branch_routes/input_data]
connect_bd_net -net rst_ps8_0_99M_peripheral_aresetn [get_bd_pins reset] \
  [get_bd_pins util_ff_routes_lower/reset] [get_bd_pins util_ff_routes_upper/reset]
connect_bd_net -net selector_0_1 [get_bd_pins selector_0] [get_bd_pins branch_routes/selector]
connect_bd_net -net util_ff_mapping_lower_Q [get_bd_pins util_ff_routes_lower/Q] [get_bd_pins util_vector_logic_routes_lower/Op1]
connect_bd_net -net util_ff_mapping_upper_Q [get_bd_pins util_ff_routes_upper/Q] [get_bd_pins util_vector_logic_routes_upper/Op2]
connect_bd_net -net util_vector_logic_mapping_lower_Res [get_bd_pins util_vector_logic_routes_lower/Res] \
  [get_bd_pins xlconcat_routes_ready/In0] [get_bd_pins lower_valid]
connect_bd_net -net util_vector_logic_mapping_upper_Res [get_bd_pins util_vector_logic_routes_upper/Res] \
  [get_bd_pins xlconcat_routes_ready/In1] [get_bd_pins upper_valid]
connect_bd_net -net xlconcat_mapping_ready_dout [get_bd_pins xlconcat_routes_ready/dout] [get_bd_pins branch_routes/output_ready]
connect_bd_net -net xlconstant_val_1_dout [get_bd_pins clk_enable] \
  [get_bd_pins util_ff_routes_lower/clk_enable] [get_bd_pins util_ff_routes_upper/clk_enable]
connect_bd_net -net xlslice_mapping_data_lower_Dout [get_bd_pins xlslice_weights_data_lower/Dout] \
  [get_bd_pins xlslice_routes_lower_addr/Din] [get_bd_pins xlslice_routes_lower_data/Din]
connect_bd_net -net xlslice_mapping_data_upper_Dout [get_bd_pins xlslice_weights_data_upper/Dout] \
  [get_bd_pins xlslice_routes_upper_addr/Din] [get_bd_pins xlslice_routes_upper_data/Din]
connect_bd_net -net xlslice_mapping_valid_lower_Dout [get_bd_pins xlslice_routes_valid_lower/Dout] \
  [get_bd_pins util_ff_routes_lower/D] [get_bd_pins util_vector_logic_routes_lower/Op2]
connect_bd_net -net xlslice_mapping_valid_upper_Dout [get_bd_pins xlslice_routes_valid_upper/Dout] \
  [get_bd_pins util_ff_routes_upper/D] [get_bd_pins util_vector_logic_routes_upper/Op1]
connect_bd_net -net xlslice_routes_lower_addr_Dout [get_bd_pins xlslice_routes_lower_addr/Dout] [get_bd_pins lower_addr]
connect_bd_net -net xlslice_routes_upper_addr_Dout [get_bd_pins xlslice_routes_upper_addr/Dout] [get_bd_pins upper_addr]
connect_bd_net -net xlslice_weights_lower_data_Dout [get_bd_pins xlslice_routes_lower_data/Dout] [get_bd_pins lower_data]
connect_bd_net -net xlslice_weights_upper_data_Dout [get_bd_pins xlslice_routes_upper_data/Dout] [get_bd_pins upper_data]
connect_bd_net -net zynq_ultra_ps_e_0_pl_clk0 [get_bd_pins clk] [get_bd_pins util_ff_routes_lower/clk] [get_bd_pins util_ff_routes_upper/clk]
set_property HDL_ATTRIBUTE.DEBUG true [get_bd_nets util_vector_logic_mapping_lower_Res]
set_property HDL_ATTRIBUTE.DEBUG true [get_bd_nets util_vector_logic_mapping_upper_Res]
set_property HDL_ATTRIBUTE.MARK_DEBUG true [get_bd_nets util_vector_logic_mapping_upper_Res]
set_property HDL_ATTRIBUTE.DEBUG true [get_bd_nets xlslice_routes_lower_addr_Dout]
set_property HDL_ATTRIBUTE.DEBUG true [get_bd_nets xlslice_routes_upper_addr_Dout]
set_property HDL_ATTRIBUTE.DEBUG true [get_bd_nets xlslice_weights_lower_data_Dout]
set_property HDL_ATTRIBUTE.DEBUG true [get_bd_nets xlslice_weights_upper_data_Dout]

current_bd_instance /write_path_leak_lut
connect_bd_net -net axis_dwidth_converter_mapping_m_axis_tvalid [get_bd_pins input_valid] [get_bd_pins branch_leak_lut/input_valid]
connect_bd_net -net branch_mapping_input_ready [get_bd_pins branch_leak_lut/input_ready] [get_bd_pins input_ready]
connect_bd_net -net branch_mapping_output_data [get_bd_pins branch_leak_lut/output_data] \
  [get_bd_pins xlslice_leak_lut_data_lower/Din] [get_bd_pins xlslice_leak_lut_data_upper/Din]
connect_bd_net -net branch_mapping_output_valid [get_bd_pins branch_leak_lut/output_valid] \
  [get_bd_pins xlslice_leak_lut_valid_upper/Din] [get_bd_pins xlslice_leak_lut_valid_lower/Din]
connect_bd_net [get_bd_pins input_data] [get_bd_pins branch_leak_lut/input_data]
connect_bd_net -net rst_ps8_0_99M_peripheral_aresetn [get_bd_pins reset] \
  [get_bd_pins util_ff_leak_lut_lower/reset] [get_bd_pins util_ff_leak_lut_upper/reset]
connect_bd_net -net selector_0_1 [get_bd_pins selector_0] [get_bd_pins branch_leak_lut/selector]
connect_bd_net -net util_ff_mapping_lower_Q [get_bd_pins util_ff_leak_lut_lower/Q] [get_bd_pins util_vector_logic_leak_lut_lower/Op1]
connect_bd_net -net util_ff_mapping_upper_Q [get_bd_pins util_ff_leak_lut_upper/Q] [get_bd_pins util_vector_logic_leak_lut_upper/Op2]
connect_bd_net -net util_vector_logic_mapping_lower_Res [get_bd_pins util_vector_logic_leak_lut_lower/Res] \
  [get_bd_pins xlconcat_leak_lut_ready/In0] [get_bd_pins lower_valid]
connect_bd_net -net util_vector_logic_mapping_upper_Res [get_bd_pins util_vector_logic_leak_lut_upper/Res] \
  [get_bd_pins xlconcat_leak_lut_ready/In1] [get_bd_pins upper_valid]
connect_bd_net -net xlconcat_mapping_ready_dout [get_bd_pins xlconcat_leak_lut_ready/dout] [get_bd_pins branch_leak_lut/output_ready]
connect_bd_net -net xlconstant_val_1_dout [get_bd_pins clk_enable] \
  [get_bd_pins util_ff_leak_lut_lower/clk_enable] [get_bd_pins util_ff_leak_lut_upper/clk_enable]
connect_bd_net -net xlslice_leak_lut_lower_addr_Dout [get_bd_pins xlslice_leak_lut_lower_addr/Dout] [get_bd_pins lower_addr]
connect_bd_net -net xlslice_leak_lut_lower_data_Dout [get_bd_pins xlslice_leak_lut_lower_data/Dout] [get_bd_pins lower_data]
connect_bd_net -net xlslice_leak_lut_upper_addr_Dout [get_bd_pins xlslice_leak_lut_upper_addr/Dout] [get_bd_pins upper_addr]
connect_bd_net -net xlslice_leak_lut_upper_data_Dout [get_bd_pins xlslice_leak_lut_upper_data/Dout] [get_bd_pins upper_data]
connect_bd_net -net xlslice_mapping_data_lower_Dout [get_bd_pins xlslice_leak_lut_data_lower/Dout] \
  [get_bd_pins xlslice_leak_lut_lower_addr/Din] [get_bd_pins xlslice_leak_lut_lower_data/Din]
connect_bd_net -net xlslice_mapping_data_upper_Dout [get_bd_pins xlslice_leak_lut_data_upper/Dout] \
  [get_bd_pins xlslice_leak_lut_upper_addr/Din] [get_bd_pins xlslice_leak_lut_upper_data/Din]
connect_bd_net -net xlslice_mapping_valid_lower_Dout [get_bd_pins xlslice_leak_lut_valid_lower/Dout] \
  [get_bd_pins util_ff_leak_lut_lower/D] [get_bd_pins util_vector_logic_leak_lut_lower/Op2]
connect_bd_net -net xlslice_mapping_valid_upper_Dout [get_bd_pins xlslice_leak_lut_valid_upper/Dout] \
  [get_bd_pins util_ff_leak_lut_upper/D] [get_bd_pins util_vector_logic_leak_lut_upper/Op1]
connect_bd_net -net zynq_ultra_ps_e_0_pl_clk0 [get_bd_pins clk] [get_bd_pins util_ff_leak_lut_lower/clk] [get_bd_pins util_ff_leak_lut_upper/clk]
set_property HDL_ATTRIBUTE.DEBUG true [get_bd_nets util_vector_logic_mapping_lower_Res]
set_property HDL_ATTRIBUTE.DEBUG true [get_bd_nets util_vector_logic_mapping_upper_Res]
set_property HDL_ATTRIBUTE.DEBUG true [get_bd_nets xlslice_leak_lut_lower_addr_Dout]
set_property HDL_ATTRIBUTE.DEBUG true [get_bd_nets xlslice_leak_lut_lower_data_Dout]
set_property HDL_ATTRIBUTE.DEBUG true [get_bd_nets xlslice_leak_lut_upper_addr_Dout]
set_property HDL_ATTRIBUTE.DEBUG true [get_bd_nets xlslice_leak_lut_upper_data_Dout]

current_bd_instance /
connect_bd_intf_net [get_bd_intf_pins axi_dma_0/M_AXIS_MM2S] [get_bd_intf_pins axis_data_fifo_input/S_AXIS]
connect_bd_intf_net [get_bd_intf_pins axi_dma_0/M_AXI_MM2S] [get_bd_intf_pins axi_smc/S00_AXI]
connect_bd_intf_net [get_bd_intf_pins axi_dma_0/M_AXI_S2MM] [get_bd_intf_pins axi_smc/S01_AXI]
connect_bd_intf_net -intf_net axi_fifo_mm_s_0_AXI_STR_TXD [get_bd_intf_pins axi_fifo_mm_s_routes/AXI_STR_TXD] [get_bd_intf_pins axis_dwidth_converter_routes/S_AXIS]
connect_bd_intf_net [get_bd_intf_pins axis_data_fifo_leak_lut/S_AXIS] [get_bd_intf_pins axi_fifo_mm_s_leak_lut/AXI_STR_TXD]
connect_bd_intf_net [get_bd_intf_pins axis_dwidth_converter_mapping/S_AXIS] [get_bd_intf_pins axi_fifo_mm_s_mapping/AXI_STR_TXD]
connect_bd_intf_net [get_bd_intf_pins axi_fifo_mm_s_weights/AXI_STR_TXD] [get_bd_intf_pins axis_dwidth_converter_weights/S_AXIS]
connect_bd_intf_net [get_bd_intf_pins axi_smc/M00_AXI] [get_bd_intf_pins zynq_ultra_ps_e_0/S_AXI_HPC0_FPD]
connect_bd_intf_net [get_bd_intf_pins ps8_0_axi_periph/M00_AXI] [get_bd_intf_pins axi_ctrl_0/S_AXI]
connect_bd_intf_net [get_bd_intf_pins ps8_0_axi_periph/M01_AXI] [get_bd_intf_pins axi_intc_0/s_axi]
connect_bd_intf_net [get_bd_intf_pins ps8_0_axi_periph/M02_AXI] [get_bd_intf_pins axi_dma_0/S_AXI_LITE]
connect_bd_intf_net [get_bd_intf_pins ps8_0_axi_periph/M03_AXI] [get_bd_intf_pins axi_stat_cyc_cnt/S_AXI]
connect_bd_intf_net [get_bd_intf_pins ps8_0_axi_periph/M04_AXI] [get_bd_intf_pins axi_fifo_mm_s_routes/S_AXI]
connect_bd_intf_net [get_bd_intf_pins ps8_0_axi_periph/M05_AXI] [get_bd_intf_pins axi_fifo_mm_s_weights/S_AXI]
connect_bd_intf_net [get_bd_intf_pins ps8_0_axi_periph/M06_AXI] [get_bd_intf_pins axi_fifo_mm_s_mapping/S_AXI]
connect_bd_intf_net [get_bd_intf_pins ps8_0_axi_periph/M07_AXI] [get_bd_intf_pins debug_bridge_0/S_AXI]
connect_bd_intf_net [get_bd_intf_pins ps8_0_axi_periph/M08_AXI] [get_bd_intf_pins axi_ctrl_1/S_AXI]
connect_bd_intf_net [get_bd_intf_pins ps8_0_axi_periph/M09_AXI] [get_bd_intf_pins axi_fifo_mm_s_leak_lut/S_AXI]
connect_bd_intf_net [get_bd_intf_pins zynq_ultra_ps_e_0/M_AXI_HPM0_FPD] [get_bd_intf_pins ps8_0_axi_periph/S00_AXI]
connect_bd_net [get_bd_pins axi_ctrl_1/gpio_io_o] \
  [get_bd_pins xlslice_15_0_core_top_tau_mem_inv/Din] [get_bd_pins xlslice_31_16_out_core_tau_mem_inv/Din]
connect_bd_net -net axi_ctrl_gpio2_io_o [get_bd_pins axi_ctrl_0/gpio2_io_o] [get_bd_pins xlslice_23_0_num_ts/Din]
connect_bd_net -net axi_ctrl_gpio_io_o [get_bd_pins axi_ctrl_0/gpio_io_o] \
  [get_bd_pins xlslice_1_rst/Din] [get_bd_pins xlslice_0_ena/Din] [get_bd_pins xlslice_3_intr_in/Din] \
  [get_bd_pins xlslice_12_3_num_out_neur/Din] [get_bd_pins xlslice_14_13_sel_weights/Din] \
  [get_bd_pins xlslice_16_15_sel_mapping/Din] [get_bd_pins xlslice_18_17_sel_routes/Din] \
  [get_bd_pins xlslice_18_17_sel_leak_lut/Din]
connect_bd_net [get_bd_pins axi_dma_0/mm2s_introut] [get_bd_pins xlconcat_intrs/In0]
connect_bd_net [get_bd_pins axi_dma_0/s2mm_introut] [get_bd_pins xlconcat_intrs/In1]
connect_bd_net [get_bd_pins axi_dma_0/s_axis_s2mm_tready] [get_bd_pins axis_data_fifo_output/m_axis_tready]
connect_bd_net [get_bd_pins axi_intc_0/irq] [get_bd_pins zynq_ultra_ps_e_0/pl_ps_irq0]
connect_bd_net -net axis_data_fifo_input_m_axis_tdata [get_bd_pins axis_data_fifo_input/m_axis_tdata] \
  [get_bd_pins system_ila_0/probe22] [get_bd_pins nice_interface_0/input_fifo_data_i]
connect_bd_net -net axis_data_fifo_input_m_axis_tvalid [get_bd_pins axis_data_fifo_input/m_axis_tvalid] \
  [get_bd_pins system_ila_0/probe23] [get_bd_pins nice_interface_0/input_fifo_valid_i]
connect_bd_net [get_bd_pins axis_data_fifo_leak_lut/m_axis_tdata] [get_bd_pins write_path_leak_lut/input_data]
connect_bd_net [get_bd_pins axis_data_fifo_leak_lut/m_axis_tvalid] [get_bd_pins write_path_leak_lut/input_valid]
connect_bd_net [get_bd_pins axis_data_fifo_output/m_axis_tdata] [get_bd_pins axi_dma_0/s_axis_s2mm_tdata]
connect_bd_net [get_bd_pins axis_data_fifo_output/m_axis_tlast] [get_bd_pins axi_dma_0/s_axis_s2mm_tlast]
connect_bd_net [get_bd_pins axis_data_fifo_output/m_axis_tvalid] [get_bd_pins axi_dma_0/s_axis_s2mm_tvalid]
connect_bd_net -net axis_data_fifo_output_s_axis_tready [get_bd_pins axis_data_fifo_output/s_axis_tready] \
  [get_bd_pins system_ila_0/probe18] [get_bd_pins nice_interface_0/output_fifo_ready_i]
connect_bd_net [get_bd_pins axis_dwidth_converter_mapping/m_axis_tdata] [get_bd_pins write_path_mapping/input_data]
connect_bd_net [get_bd_pins axis_dwidth_converter_mapping/m_axis_tvalid] [get_bd_pins write_path_mapping/input_valid]
connect_bd_net [get_bd_pins axis_dwidth_converter_routes/m_axis_tdata] [get_bd_pins write_path_routes/input_data_0]
connect_bd_net [get_bd_pins axis_dwidth_converter_routes/m_axis_tvalid] [get_bd_pins write_path_routes/input_valid]
connect_bd_net [get_bd_pins axis_dwidth_converter_weights/m_axis_tdata] [get_bd_pins write_path_weights/input_data_0]
connect_bd_net [get_bd_pins axis_dwidth_converter_weights/m_axis_tvalid] [get_bd_pins write_path_weights/input_valid]
connect_bd_net -net branch_mapping_input_ready [get_bd_pins write_path_mapping/input_ready] [get_bd_pins axis_dwidth_converter_mapping/m_axis_tready]
connect_bd_net -net nice_interface_0_input_fifo_ready_o [get_bd_pins nice_interface_0/input_fifo_ready_o] \
  [get_bd_pins axis_data_fifo_input/m_axis_tready] [get_bd_pins system_ila_0/probe24]
connect_bd_net [get_bd_pins nice_interface_0/interrupt_latency] [get_bd_pins axi_stat_cyc_cnt/gpio_io_i]
connect_bd_net -net nice_interface_0_output_fifo_data_o [get_bd_pins nice_interface_0/output_fifo_data_o] \
  [get_bd_pins axis_data_fifo_output/s_axis_tdata] [get_bd_pins system_ila_0/probe19]
connect_bd_net -net nice_interface_0_output_fifo_last_o [get_bd_pins nice_interface_0/output_fifo_last_o] \
  [get_bd_pins axis_data_fifo_output/s_axis_tlast] [get_bd_pins system_ila_0/probe20]
connect_bd_net -net nice_interface_0_output_fifo_valid_o [get_bd_pins nice_interface_0/output_fifo_valid_o] \
  [get_bd_pins axis_data_fifo_output/s_axis_tvalid] [get_bd_pins system_ila_0/probe21]
connect_bd_net [get_bd_pins rst_ps8_0_99M/peripheral_aresetn] \
  [get_bd_pins ps8_0_axi_periph/S00_ARESETN] [get_bd_pins axi_ctrl_0/s_axi_aresetn] \
  [get_bd_pins ps8_0_axi_periph/M00_ARESETN] [get_bd_pins ps8_0_axi_periph/ARESETN] [get_bd_pins axi_intc_0/s_axi_aresetn] \
  [get_bd_pins ps8_0_axi_periph/M01_ARESETN] [get_bd_pins axi_dma_0/axi_resetn] [get_bd_pins ps8_0_axi_periph/M02_ARESETN] \
  [get_bd_pins axi_smc/aresetn] [get_bd_pins axis_data_fifo_output/s_axis_aresetn] \
  [get_bd_pins axis_data_fifo_input/s_axis_aresetn] [get_bd_pins util_ff_0/reset] \
  [get_bd_pins axi_stat_cyc_cnt/s_axi_aresetn] [get_bd_pins ps8_0_axi_periph/M03_ARESETN] \
  [get_bd_pins axi_fifo_mm_s_routes/s_axi_aresetn] [get_bd_pins ps8_0_axi_periph/M04_ARESETN] \
  [get_bd_pins axis_dwidth_converter_routes/aresetn] [get_bd_pins axi_fifo_mm_s_weights/s_axi_aresetn] \
  [get_bd_pins axis_dwidth_converter_weights/aresetn] [get_bd_pins ps8_0_axi_periph/M05_ARESETN] \
  [get_bd_pins axi_fifo_mm_s_mapping/s_axi_aresetn] [get_bd_pins ps8_0_axi_periph/M06_ARESETN] \
  [get_bd_pins axis_dwidth_converter_mapping/aresetn] [get_bd_pins write_path_mapping/reset] \
  [get_bd_pins write_path_weights/reset] [get_bd_pins write_path_routes/reset] [get_bd_pins ps8_0_axi_periph/M07_ARESETN] \
  [get_bd_pins debug_bridge_0/s_axi_aresetn] [get_bd_pins axi_ctrl_1/s_axi_aresetn] \
  [get_bd_pins ps8_0_axi_periph/M08_ARESETN] [get_bd_pins axi_fifo_mm_s_leak_lut/s_axi_aresetn] \
  [get_bd_pins ps8_0_axi_periph/M09_ARESETN] [get_bd_pins axis_data_fifo_leak_lut/s_axis_aresetn] \
  [get_bd_pins write_path_leak_lut/reset]
connect_bd_net [get_bd_pins util_ff_0/Q] [get_bd_pins util_vector_logic_intr/Op1]
connect_bd_net [get_bd_pins util_vector_logic_intr/Res] [get_bd_pins util_vector_logic_intr_flank/Op2]
connect_bd_net [get_bd_pins util_vector_logic_intr_flank/Res] [get_bd_pins nice_interface_0/interrupt_i]
connect_bd_net [get_bd_pins write_path_leak_lut/input_ready] [get_bd_pins axis_data_fifo_leak_lut/m_axis_tready]
connect_bd_net -net write_path_leak_lut_lower_addr [get_bd_pins write_path_leak_lut/lower_addr] \
  [get_bd_pins system_ila_0/probe25] [get_bd_pins nice_interface_0/core_top_neuron_leak_ram_addr_i]
